# Altium schematic sheet OLED_128x32.SchDoc
size A4; SheetNumber: 3; SheetTotal: 4
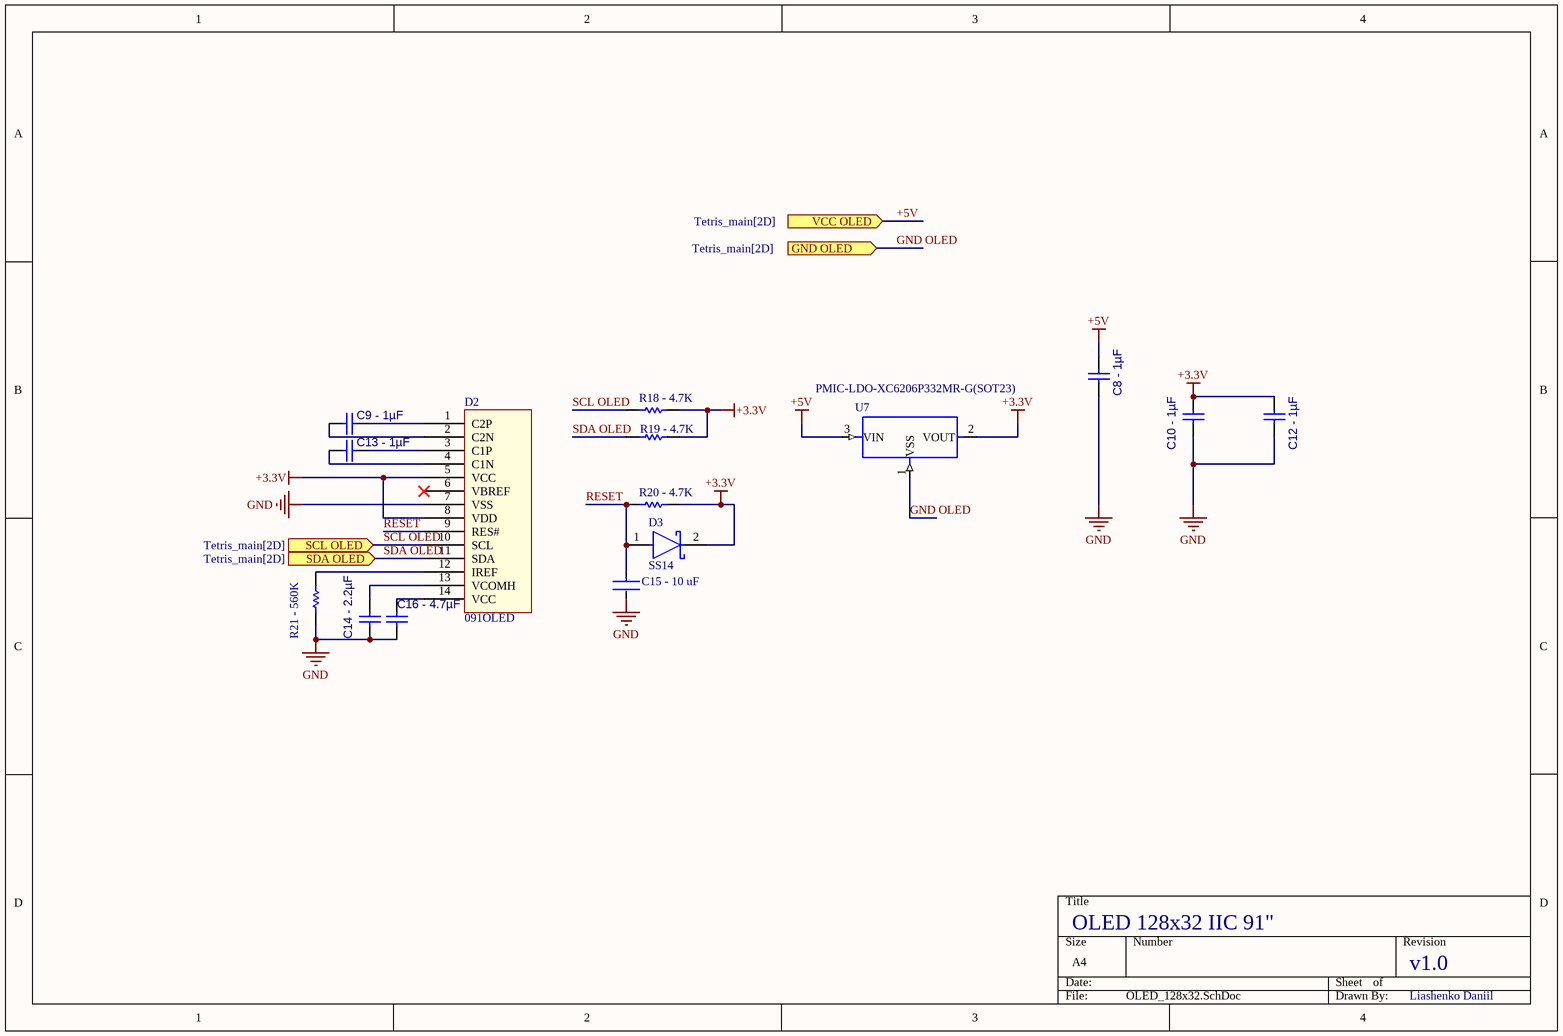
[diagram p0: OLED_128x32.SchDoc]

## Parts
C8_-_1µF  Capacitor 1uF +/- 10% 16V 0603  [CAPC1608X90X35ML15T15]  (value not drawn)
C9_-_1µF  Capacitor 1uF +/- 10% 16V 0603  [CAPC1608X90X35ML15T15]  (value not drawn)
C10_-_1µF  Capacitor 1uF +/- 10% 16V 0603  [CAPC1608X90X35ML15T15]  (value not drawn)
C12_-_1µF  Capacitor 1uF +/- 10% 16V 0603  [CAPC1608X90X35ML15T15]  (value not drawn)
C13_-_1µF  Capacitor 1uF +/- 10% 16V 0603  [CAPC1608X90X35ML15T15]  (value not drawn)
C14_-_2.2µF  Capacitor 2,2µF +/-20% 10V 0402  [CAPC0402(1005)60_L]  (value not drawn)
C15_-_10_uF  GRM188R60J106ME47D  [FP-GRM188-0_1-e0_2_0_55-IPC_A]  (value not drawn)
C16_-_4.7µF  Capacitor 4.7µF +/-20% 10V 0603  [CAPC0603(1608)100_L]  (value not drawn)
D2  091OLED  [091OLED]
D3  SS14  [FP-403AE-MFG]
R18_-_4.7K  RC0603JR-074K7L  [RESC1608X55X25ML10T15]  (value not drawn)
R19_-_4.7K  RC0603JR-074K7L  [RESC1608X55X25ML10T15]  (value not drawn)
R20_-_4.7K  RC0603JR-074K7L  [RESC1608X55X25ML10T15]  (value not drawn)
R21_-_560K  ERA6AEB564V  [RESC2013X60X40ML20T25]  (value not drawn)
U7  PMIC-LDO-XC6206P332MR-G(SOT23)  [SOT-23]

## Ports
GND OLED (in, see Tetris_main[2D]), SCL OLED (in, see Tetris_main[2D]), SDA OLED (in, see Tetris_main[2D]), VCC OLED (in, see Tetris_main[2D])

## Nets
+3.3V: C10_-_1µF.1 C12_-_1µF.1 D2.5(VCC) D2.8(VDD) D3.2(C) R18_-_4.7K.1 R19_-_4.7K.1 R20_-_4.7K.1 U7.2(VOUT)
+5V: C8_-_1µF.1 U7.3(VIN) ; port VCC OLED
GND: C8_-_1µF.2 C10_-_1µF.2 C12_-_1µF.2 C14_-_2.2µF.2 C15_-_10_uF.2 C16_-_4.7µF.1 D2.7(VSS) R21_-_560K.1
GND OLED: U7.1(VSS) ; port GND OLED
RESET: C15_-_10_uF.1 D2.9(RES#) D3.1(A) R20_-_4.7K.2
SCL OLED: D2.10(SCL) R18_-_4.7K.2 ; port SCL OLED
SDA OLED: D2.11(SDA) R19_-_4.7K.2 ; port SDA OLED
NetC9_-_1µF_1: C9_-_1µF.1 D2.1(C2P)
NetC9_-_1µF_2: C9_-_1µF.2 D2.2(C2N)
NetC13_-_1µF_1: C13_-_1µF.1 D2.3(C1P)
NetC13_-_1µF_2: C13_-_1µF.2 D2.4(C1N)
NetC14_-_2.2µF_1: C14_-_2.2µF.1 D2.13(VCOMH)
NetC16_-_4.7µF_2: C16_-_4.7µF.2 D2.14(VCC)
NetD2_12: D2.12(IREF) R21_-_560K.2

Not connected (* = marked no-connect by the designer): D2 6(VBREF)*

## Notes on the sheet
- OLED 128x32 IIC 91"
- v1.0
- Liashenko Daniil

## Library data of the parts
C8_-_1µF C9_-_1µF C10_-_1µF C12_-_1µF C13_-_1µF = CMP-001-00004-6: Chip Capacitor, 1 uF, +/- 10%, 16 V, 0603 (1608 Metric); Capacitor Type: Ceramic; Mounting Technology: SM; RoHS Compliant: True; Min Operating Temperature: -55°C; Case/Package: 0603; Pins: 2; Voltage Rating: 16V; Max Operating Temperature: 125°C; Tolerance: 10%
C14_-_2.2µF = CMP-001-00056-4: Chip Capacitor, 2,2µF +/-20%, 10V, 0402, Thickness 0.6 mm; Tolerance: 10%; Mounting Technology: SMT; Max Operating Temperature: 85°C; Case/Package: 0402; Pins: 2; Min Operating Temperature: -55°C; Voltage Rating: 10V
C15_-_10_uF = CMP-2006-02792-2: Chip Multilayer Ceramic Capacitors for General Purpose, 0603, 10uF, X5R, 15%, 20%, 6.3V; Packaging: Tape and Reel; Voltage Rating (DC): 6.3V; Width: 0.031inch; Termination: SMD/SMT; Dielectric: X5R; Package Quantity: 4000; Voltage Rating: 6.3V; Capacitance: 10uF; Case/Package: 0603; Min Operating Temperature: -55°C; Voltage: 6.3V; Length: 1.6mm; Thickness: 0.035inch; Lead Free: Lead Free; Depth: 0.8mm; Case Code (Imperial): 0603; Max Operating Temperature: 85°C; Material: Ceramic; Height: 0.8mm; Tolerance: 20%; Mount: Surface Mount; REACH SVHC: No SVHC; Radiation Hardening: No; Case Code (Metric): 1608
C16_-_4.7µF = CMP-001-00076-4: Chip Capacitor, 4.7µF +/-20%, 10V, 0603, Thickness 1 mm; Tolerance: 10%; Mounting Technology: SMT; Case/Package: 0603; Pins: 2; Min Operating Temperature: -55°C; Max Operating Temperature: 85°C; Voltage Rating: 10V
D2 = CMP-004-00034-1: Design Item ID: 091OLED; Source: 0.91inch_OLED_Schematic_Package_Library.SCHLIB
D3 = CMP-2000-04943-2: DIODE SCHOTTKY 40V 1A SMA; Manufacturer: ON Semiconductor; Peak Reverse Current: 0.2mA; Max Junction Temp: +125°C; Standoff Height: 0.05mm; Max Surge Forward Current: 40A; Mouser Description: Schottky Diodes & Rectifiers SMA 40V 1.0A; RoHS: TRUE; Lead Free: Yes; Manufacturer Part Number: SS14; Device Class L3: Schottky Diodes; Category: Diode; Automotive: No; Digikey Description: DIODE SCHOTTKY 40V 1A SMA; ComponentLink2Description: Datasheet; Device Class L2: Diodes; Height: 2.5mm; Temperature Range High: +125°C; ComponentLink2URL: https://www.onsemi.com/pub/Collateral/SS19-D.PDF; Device Class L1: Discrete Semiconductors; Package: 403AE; Octopart: https://octopart.com/ss14-on+semiconductor-29205033; Max Repetitive Reverse Voltage: 40V; Temperature Range Low: -65°C; Forward Current: 1A; Temperature: -65°C to +125°C
R18_-_4.7K R19_-_4.7K R20_-_4.7K = CMP-2000-05024-1: Chip Resistor, 4.7 KOhm, +/- 5%, 100 mW, -55 to 155 degC, 0603 (1608 Metric), RoHS, Tape and Reel; Manufacturer: Yageo; Resistance: 4.7kOhms; Temperature Coefficient: 100PPM/C; Power Rating: 100mW; Voltage Rating: 50V; Operating Temperature Range: -55Cto+155C; Case Code - mm: 1608; Tolerance: 5%; Product: ThickFilmResistorsGeneralPurpose; Case Code - in: 0603; Datasheet URL: http://www.yageo.com/documents/recent/PYu-RC_Group_51_RoHS_L_04.pdf; Package Reference: 603; Datasheet Version: Rev. 4, 02/2016; Package Description: 2-Pin Surface Mount Device, Body 1.6 x 0.8 mm; Manufacturer URL: http://www.yageo.com/; Series: RC; Packaging: Reel; Termination Style: SMD/SMT
R21_-_560K = CMP-2001-00655-1: Manufacturer: Panasonic; Part Number: ERA6AEB564V
U7 = CMP-031-00015-5: Linear Voltage Regulator IC Positive Fixed 1 Output 200mA SOT-23; MF: Torex; Price: None; Source: PMIC-LDO-XC6206P332MR-G(SOT23).SchLib; MP: XC6206P332MR-G; Check_prices: https://www.snapeda.com/parts/XC6206P332MR-G/Torex/view-part/?ref=eda; Case/Package: SOT-23-3 Torex; SnapEDA_Link: https://www.snapeda.com/parts/XC6206P332MR-G/Torex/view-part/?ref=snap; Availability: In Stock; Value: *; Design Item ID: PMIC-LDO-XC6206P332MR-G(SOT23); Component Type: Standard; Pins: 3; Purchase-URL: https://pricing.snapeda.com/search/part/XC6206P332MR-G/?ref=eda